# EAGLE design Breadboard_Supply_5V (EAGLE 7.3.0)
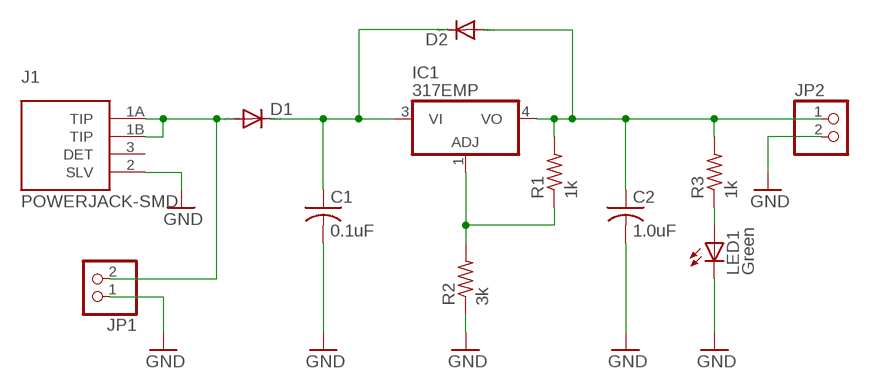
[diagram p0: schematic, sheet 1]

## Parts
C1  0.1uF  C-USC0805  [C0805]
C2  1.0uF  C-USC0805  [C0805]
D1  DIODE-SMB  [SMB]
D2  DIODE-SMB  [SMB]
IC1  317EMP  [SOT223]
J1  POWERJACK-SMD  [PJ-002AH-SMT]
JP1  PINHD-1X2  [1X02]
JP2  PINHD-1X2  [1X02]
LED1  Green  LEDCHIPLED_0805  [CHIPLED_0805]
R1  1k  R-US_R0805  [R0805]
R2  3k  R-US_R0805  [R0805]
R3  1k  R-US_R0805  [R0805]

## Nets
GND: C1.2 C2.2 J1.2(SLV) JP1.1 JP2.2 LED1.C R2.1
N$1: D1.A J1.1A(TIP) J1.1B(TIP) JP1.2
N$5: C1.1 D1.C D2.C IC1.3(VI)
N$6: IC1.1(ADJ) R1.1 R2.2
N$7: C2.1 D2.A IC1.4(VO) JP2.1 R1.2 R3.2
N$9: LED1.A R3.1
Unconnected: J1.3(DET)

## Library data of the parts
C1 C2 = resistor:C-US: CAPACITOR, American symbol
D1 D2 = diode:DIODE-: DIODE
IC1 = linear:*317: Positive VOLTAGE REGULATOR
J1 = myLibrary:POWERJACK-SMD
JP1 JP2 = pinhead:PINHD-1X2: PIN HEADER
LED1 = led:LED: LED OSRAM: - CHIPLED LG R971, LG N971, LY N971, LG Q971, LY Q971, LO R971, LY R971 LH N974, LH R974 LS Q976, LO Q976, LY Q976 LO Q996 - Hyper CHIPLED LW Q18S LB Q993, LB Q99A, LB R99A - SideLED LS A670, LO A670, LY A670, LG A670, LP A670 LB A673, LV A673, LT A673, LW A673 LH A674 LY A675 LS A676, LA A676, LO A676, LY A676, LW A676 LS A679, LY A679, LG A679 - Hyper Micro SIDELED® LS Y876, LA Y876, LO Y876, LY Y876 LT Y87S - SmartLED LW L88C, LW L88S LB L89C, LB L89S, LG L890 LS L89K, LO L89K, LY L89K LS L896, LA L896, LO L896, LY L896 - TOPLED LS T670, LO T670, LY T670, LG T670, LP T670 LSG T670, LSP T670, LSY T670, LOP T670, LYG T670 LG T671, LOG T671, LSG T671 LB T673, LV T673, LT T673, LW T673 LH T674 LS T676, LA T676, LO T676, LY T676, LB T676, LH T676, LSB T676, LW T676 LB T67C, LV T67C, LT T67C, LS T67K, LO T67K, LY T67K, LW E67C LS E67B, LA E67B, LO E67B, LY E67B, LB E67C, LV E67C, LT E67C LW T67C LS T679, LY T679, LG T679 LS T770, LO T770, LY T770, LG T770, LP T770 LB T773, LV T773, LT T773, LW T773 LH T774 LS E675, LA E675, LY E675, LS T675 LS T776, LA T776, LO T776, LY T776, LB T776 LHGB T686 LT T68C, LB T68C - Hyper Mini TOPLED® LB M676 - Mini TOPLED Santana® LG M470 LS M47K, LO M47K, LY M47K Source: http://www.osram.convergy.de LUXEON: - LUMILED® LXK2-PW12-R00, LXK2-PW12-S00, LXK2-PW14-U00, LXK2-PW14-V00 LXK2-PM12-R00, LXK2-PM12-S00, LXK2-PM14-U00 LXK2-PE12-Q00, LXK2-PE12-R00, LXK2-PE12-S00, LXK2-PE14-T00, LXK2-PE14-U00 LXK2-PB12-K00, LXK2-PB12-L00, LXK2-PB12-M00, LXK2-PB14-N00, LXK2-PB14-P00, LXK2-PB14-Q00 LXK2-PR12-L00, LXK2-PR12-M00, LXK2-PR14-Q00, LXK2-PR14-R00 LXK2-PD12-Q00, LXK2-PD12-R00, LXK2-PD12-S00 LXK2-PH12-R00, LXK2-PH12-S00 LXK2-PL12-P00, LXK2-PL12-Q00, LXK2-PL12-R00 Source: www.luxeon.com KINGBRIGHT: KA-3528ASYC Source: www.kingbright.com
R1-R3 = resistor:R-US_: RESISTOR, American symbol

## Board
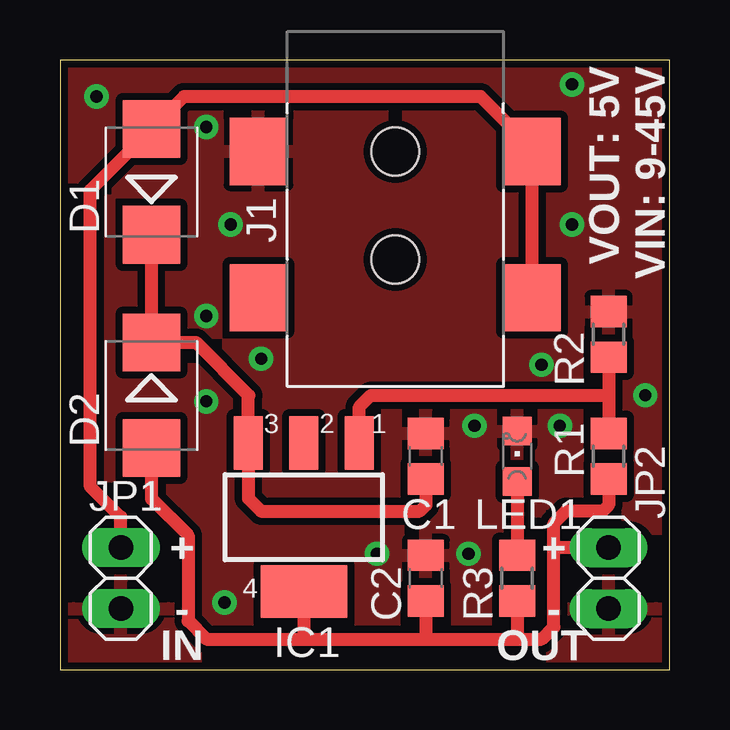
[diagram p1: board, top side]
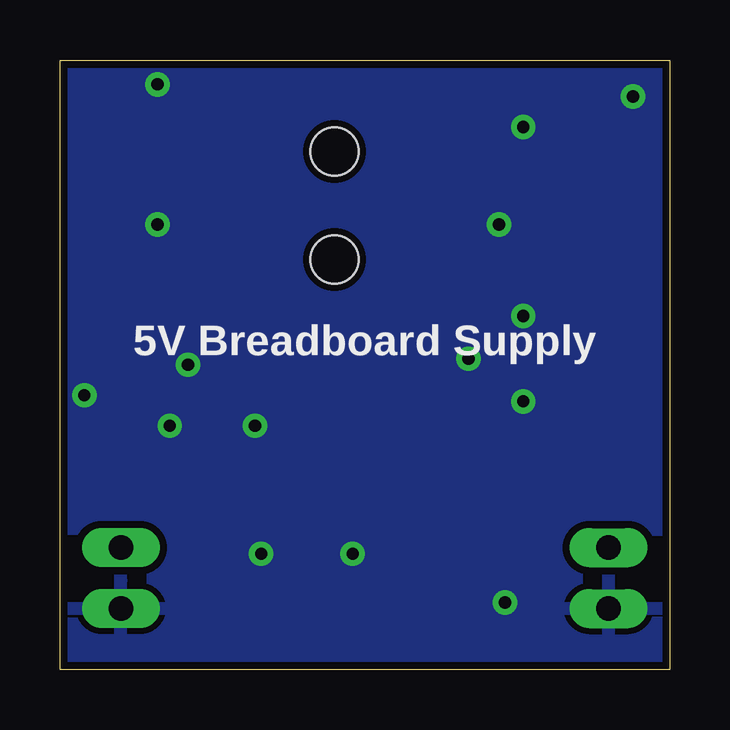
[diagram p2: board, bottom side, seen from below]

Size 25.4 x 25.4 mm. Coordinates in mm from the lower left corner, seen from the top.
Outline: 0,0 25.4,0 25.4,25.4 0,25.4 0,0
Copper layers (1*16): Top 0.035mm / dielectric 1.5mm / Bottom 0.035mm
Design rules "SparkFun-2-layer": minimum track width 7mil, minimum drill 15mil, track to track 8mil, track to pad 8mil, pad to pad 8mil, via to via 8mil, smd to smd 8mil, copper to edge 8mil, drill to drill 8mil, minimum pad ring 12mil, minimum via ring 10mil, stop-mask expansion 4mil, vias tented up to drill 20mil, thermal gap 10mil

### Footprints (pad centres in the part's own frame; a part is rotated, then mirrored left to right if it is on the bottom)
C0805 = smd 1.3 x 1.5: 1 -0.95,0; 2 0.95,0
SMB = smd 2.4 x 2.4: A 2.2,0; C -2.2,0
SOT223 = smd 1.219 x 2.235: 1 -2.311,-3.099; 2 0,-3.099; 3 2.311,-3.099 | smd 3.6 x 2.2: 4 0,3.099
PJ-002AH-SMT = smd 2.8 x 2.4: 1A 0,5.7; 1B 6.1,5.7; 2 0,-5.7; 3 6.1,-5.7 | hole 2: 0,0; 4.5,0
1X02 = drill 1.016 long: 1 -1.27,0; 2 1.27,0
CHIPLED_0805 = smd 1.2 x 1.2: A 0,-1.05; C 0,1.05
R0805 = smd 1.3 x 1.5: 1 -0.95,0; 2 0.95,0

### Placement (x,y rotation side)
C1  15.24,8.89 90 top
C2  15.24,3.81 90 top
D1  3.81,20.32 90 top
D2  3.81,11.43 270 top
IC1  10.16,6.35 180 top
J1  13.97,21.59 270 top
JP1  2.54,3.81 90 top
JP2  22.86,3.81 270 top
LED1  19.05,8.89 0 top
R1  22.86,8.89 270 top
R2  22.86,13.97 270 top
R3  19.05,3.81 270 top

### Tracks (layer width: path | path; a pad name or v marks a point on that pad's centre or on a via)
GND  (via drill 0.51)
  other vias: 17.02,4.83 17.27,10.16 20.83,10.16 13.21,4.83 6.1,11.18 6.86,2.79 6.1,22.61 6.1,14.73 21.34,24.38 1.52,23.88 20.07,12.7 24.38,11.43 7.11,18.54 8.38,12.95 21.34,18.54
  pour Top (isolate 0.305): 0,25.4 0,0 25.4,0 25.4,25.4
  pour Bottom (isolate 0.305): 0,25.4 0,0 25.4,0 25.4,25.4
N$1
  Top 0.533: JP1.2 2.54,6.35 1.27,7.62 1.27,19.98 D1.A 5.17,23.88 17.53,23.88 19.67,21.73 J1.1A J1.1B
N$5
  Top 0.533: D1.C D2.C 5.67,13.63 7.87,11.43 7.85,11.4 IC1.3 7.85,7.14 8.38,6.6 14.99,6.6 15.24,6.86 C1.1
N$6
  Top 0.533: R2.2 22.86,11.43 | 22.86,11.43 R1.1 | IC1.1 12.47,10.95 12.95,11.43 22.86,11.43
N$7
  Top 0.533: 10.16,1.27 6.1,1.27 5.33,2.03 5.33,5.59 3.81,7.11 D2.A | 10.16,1.27 15.24,1.27 | 15.24,1.27 19.05,1.27 | 19.05,1.27 20.07,1.27 20.57,1.78 20.57,5.08 | 20.57,5.08 20.57,6.1 21.08,6.6 22.61,6.6 22.86,6.86 R1.2 | JP2.1 20.57,5.08 | R3.2 19.05,1.27 | C2.1 15.24,1.27 | IC1.4 10.16,1.27
N$9
  Top 0.533: LED1.A R3.1

### Text on the board
tPlace: VOUT: 5V / VIN: 9-45V | + | + | - | - | IN | OUT
bPlace: 5V Breadboard Supply